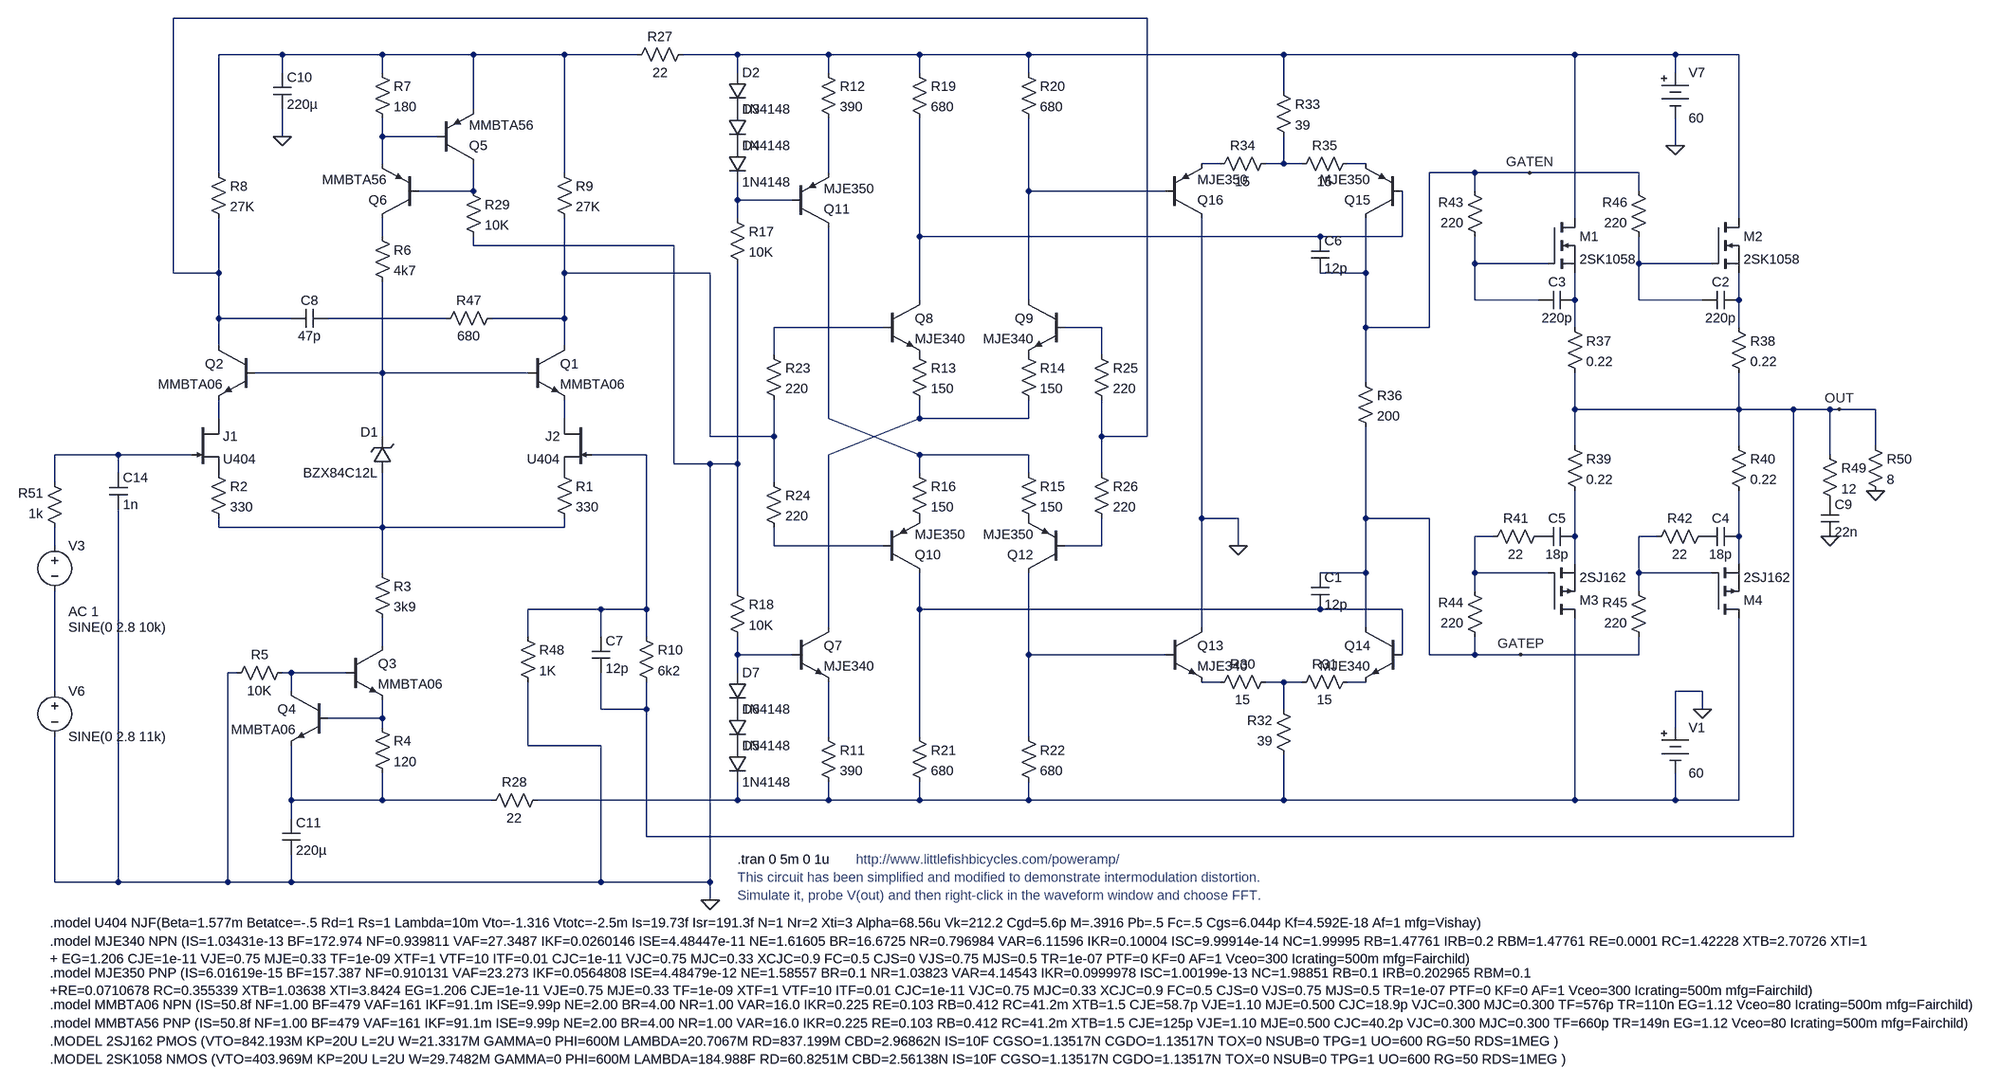
[diagram p0: schematic IMODdistort.asc]
IMODdistort.asc, the LTspice schematic file:
Version 4
SHEET 1 6100 1520
WIRE 3120 -2672 1408 -2672
WIRE 1600 -2608 1488 -2608
WIRE 1776 -2608 1600 -2608
WIRE 1936 -2608 1776 -2608
WIRE 2096 -2608 1936 -2608
WIRE 2224 -2608 2096 -2608
WIRE 2400 -2608 2304 -2608
WIRE 2560 -2608 2400 -2608
WIRE 2720 -2608 2560 -2608
WIRE 2912 -2608 2720 -2608
WIRE 3360 -2608 2912 -2608
WIRE 3872 -2608 3360 -2608
WIRE 4048 -2608 3872 -2608
WIRE 4160 -2608 4048 -2608
WIRE 1600 -2576 1600 -2608
WIRE 1776 -2576 1776 -2608
WIRE 2400 -2576 2400 -2608
WIRE 2560 -2576 2560 -2608
WIRE 2720 -2576 2720 -2608
WIRE 2912 -2576 2912 -2608
WIRE 4048 -2576 4048 -2608
WIRE 3360 -2544 3360 -2608
WIRE 1936 -2512 1936 -2608
WIRE 1600 -2464 1600 -2512
WIRE 1776 -2464 1776 -2496
WIRE 1872 -2464 1776 -2464
WIRE 4048 -2448 4048 -2496
WIRE 1776 -2416 1776 -2464
WIRE 3248 -2416 3216 -2416
WIRE 3360 -2416 3360 -2464
WIRE 3360 -2416 3328 -2416
WIRE 3392 -2416 3360 -2416
WIRE 3504 -2416 3472 -2416
WIRE 1488 -2400 1488 -2608
WIRE 2096 -2400 2096 -2608
WIRE 2560 -2400 2560 -2496
WIRE 3696 -2400 3616 -2400
WIRE 3792 -2400 3696 -2400
WIRE 3984 -2400 3792 -2400
WIRE 1936 -2368 1936 -2416
WIRE 1936 -2368 1840 -2368
WIRE 2912 -2368 2912 -2496
WIRE 3152 -2368 2912 -2368
WIRE 3696 -2368 3696 -2400
WIRE 3984 -2368 3984 -2400
WIRE 2400 -2352 2400 -2384
WIRE 2496 -2352 2400 -2352
WIRE 2400 -2320 2400 -2352
WIRE 3872 -2320 3872 -2608
WIRE 4160 -2320 4160 -2608
WIRE 1776 -2288 1776 -2320
WIRE 2720 -2288 2720 -2496
WIRE 3424 -2288 2720 -2288
WIRE 3568 -2288 3568 -2368
WIRE 3568 -2288 3424 -2288
WIRE 1936 -2272 1936 -2288
WIRE 2288 -2272 1936 -2272
WIRE 3696 -2240 3696 -2288
WIRE 3824 -2240 3696 -2240
WIRE 3984 -2240 3984 -2288
WIRE 4112 -2240 3984 -2240
WIRE 1408 -2224 1408 -2672
WIRE 1488 -2224 1488 -2320
WIRE 1488 -2224 1408 -2224
WIRE 2096 -2224 2096 -2320
WIRE 2352 -2224 2096 -2224
WIRE 3504 -2224 3504 -2320
WIRE 3504 -2224 3424 -2224
WIRE 2720 -2176 2720 -2288
WIRE 2912 -2176 2912 -2368
WIRE 3696 -2176 3696 -2240
WIRE 3808 -2176 3696 -2176
WIRE 3872 -2176 3872 -2224
WIRE 3984 -2176 3984 -2240
WIRE 4096 -2176 3984 -2176
WIRE 4160 -2176 4160 -2224
WIRE 1488 -2144 1488 -2224
WIRE 1616 -2144 1488 -2144
WIRE 1888 -2144 1680 -2144
WIRE 2096 -2144 2096 -2224
WIRE 2096 -2144 1968 -2144
WIRE 2656 -2128 2464 -2128
WIRE 3040 -2128 2976 -2128
WIRE 3504 -2128 3504 -2224
WIRE 3616 -2128 3616 -2400
WIRE 3616 -2128 3504 -2128
WIRE 3872 -2128 3872 -2176
WIRE 4160 -2128 4160 -2176
WIRE 1488 -2096 1488 -2144
WIRE 2096 -2096 2096 -2144
WIRE 2464 -2080 2464 -2128
WIRE 3040 -2080 3040 -2128
WIRE 1776 -2048 1776 -2208
WIRE 1776 -2048 1552 -2048
WIRE 2032 -2048 1776 -2048
WIRE 3504 -2032 3504 -2128
WIRE 3872 -1984 3872 -2048
WIRE 4160 -1984 4160 -2048
WIRE 4160 -1984 3872 -1984
WIRE 4256 -1984 4160 -1984
WIRE 4320 -1984 4256 -1984
WIRE 4336 -1984 4320 -1984
WIRE 4400 -1984 4336 -1984
WIRE 1488 -1968 1488 -2000
WIRE 2096 -1968 2096 -2000
WIRE 2560 -1968 2560 -2304
WIRE 2720 -1968 2720 -2000
WIRE 2912 -1968 2912 -2000
WIRE 2912 -1968 2720 -1968
WIRE 1776 -1936 1776 -2048
WIRE 2352 -1936 2352 -2224
WIRE 2464 -1936 2464 -2000
WIRE 2464 -1936 2352 -1936
WIRE 3040 -1936 3040 -2000
WIRE 3120 -1936 3120 -2672
WIRE 3120 -1936 3040 -1936
WIRE 3872 -1920 3872 -1984
WIRE 4160 -1920 4160 -1984
WIRE 4400 -1920 4400 -1984
WIRE 1312 -1904 1200 -1904
WIRE 1440 -1904 1312 -1904
WIRE 2240 -1904 2144 -1904
WIRE 2560 -1904 2720 -1968
WIRE 2720 -1904 2560 -1968
WIRE 2912 -1904 2720 -1904
WIRE 4320 -1904 4320 -1984
WIRE 2288 -1888 2288 -2272
WIRE 2352 -1888 2288 -1888
WIRE 2400 -1888 2400 -2240
WIRE 2400 -1888 2352 -1888
WIRE 1312 -1872 1312 -1904
WIRE 2720 -1872 2720 -1904
WIRE 2912 -1872 2912 -1904
WIRE 3040 -1872 3040 -1936
WIRE 1200 -1856 1200 -1904
WIRE 2464 -1856 2464 -1936
WIRE 3216 -1792 3216 -2320
WIRE 3280 -1792 3216 -1792
WIRE 3504 -1792 3504 -1952
WIRE 3616 -1792 3504 -1792
WIRE 1488 -1776 1488 -1792
WIRE 1776 -1776 1776 -1872
WIRE 1776 -1776 1488 -1776
WIRE 2096 -1776 2096 -1792
WIRE 2096 -1776 1776 -1776
WIRE 3728 -1760 3696 -1760
WIRE 3872 -1760 3872 -1840
WIRE 4016 -1760 3984 -1760
WIRE 4160 -1760 4160 -1840
WIRE 1200 -1744 1200 -1776
WIRE 2464 -1744 2464 -1776
WIRE 2656 -1744 2464 -1744
WIRE 3040 -1744 3040 -1792
WIRE 3040 -1744 2976 -1744
WIRE 3280 -1744 3280 -1792
WIRE 3872 -1712 3872 -1760
WIRE 4160 -1712 4160 -1760
WIRE 1776 -1696 1776 -1776
WIRE 3504 -1696 3504 -1792
WIRE 3504 -1696 3424 -1696
WIRE 3696 -1696 3696 -1760
WIRE 3824 -1696 3696 -1696
WIRE 3984 -1696 3984 -1760
WIRE 4112 -1696 3984 -1696
WIRE 2400 -1664 2400 -1888
WIRE 3696 -1664 3696 -1696
WIRE 3984 -1664 3984 -1696
WIRE 2160 -1632 2032 -1632
WIRE 2240 -1632 2240 -1904
WIRE 2240 -1632 2160 -1632
WIRE 2720 -1632 2720 -1696
WIRE 3424 -1632 2720 -1632
WIRE 3568 -1632 3424 -1632
WIRE 2560 -1600 2560 -1904
WIRE 3216 -1600 3216 -1792
WIRE 3504 -1600 3504 -1696
WIRE 2032 -1584 2032 -1632
WIRE 2160 -1584 2160 -1632
WIRE 2240 -1584 2240 -1632
WIRE 1776 -1568 1776 -1616
WIRE 2400 -1552 2400 -1584
WIRE 2496 -1552 2400 -1552
WIRE 2912 -1552 2912 -1696
WIRE 3152 -1552 2912 -1552
WIRE 3568 -1552 3568 -1632
WIRE 3616 -1552 3616 -1792
WIRE 3696 -1552 3696 -1584
WIRE 3696 -1552 3616 -1552
WIRE 3776 -1552 3696 -1552
WIRE 3984 -1552 3984 -1584
WIRE 3984 -1552 3776 -1552
WIRE 1520 -1520 1504 -1520
WIRE 1616 -1520 1600 -1520
WIRE 1712 -1520 1616 -1520
WIRE 2400 -1520 2400 -1552
WIRE 3248 -1504 3216 -1504
WIRE 3360 -1504 3328 -1504
WIRE 3392 -1504 3360 -1504
WIRE 3504 -1504 3472 -1504
WIRE 1200 -1488 1200 -1664
WIRE 1616 -1488 1616 -1520
WIRE 4096 -1488 4048 -1488
WIRE 2160 -1456 2160 -1520
WIRE 2240 -1456 2240 -1504
WIRE 2240 -1456 2160 -1456
WIRE 3360 -1456 3360 -1504
WIRE 4096 -1456 4096 -1488
WIRE 1776 -1440 1776 -1472
WIRE 1776 -1440 1680 -1440
WIRE 1776 -1424 1776 -1440
WIRE 4048 -1424 4048 -1488
WIRE 2560 -1408 2560 -1504
WIRE 2720 -1408 2720 -1632
WIRE 2912 -1408 2912 -1552
WIRE 2032 -1392 2032 -1504
WIRE 2160 -1392 2032 -1392
WIRE 1616 -1296 1616 -1392
WIRE 1776 -1296 1776 -1344
WIRE 1776 -1296 1616 -1296
WIRE 1968 -1296 1776 -1296
WIRE 2400 -1296 2400 -1328
WIRE 2400 -1296 2048 -1296
WIRE 2560 -1296 2560 -1328
WIRE 2560 -1296 2400 -1296
WIRE 2720 -1296 2720 -1328
WIRE 2720 -1296 2560 -1296
WIRE 2912 -1296 2912 -1328
WIRE 2912 -1296 2720 -1296
WIRE 3360 -1296 3360 -1376
WIRE 3360 -1296 2912 -1296
WIRE 3872 -1296 3872 -1616
WIRE 3872 -1296 3360 -1296
WIRE 4048 -1296 4048 -1344
WIRE 4048 -1296 3872 -1296
WIRE 4160 -1296 4160 -1616
WIRE 4160 -1296 4048 -1296
WIRE 1616 -1264 1616 -1296
WIRE 2240 -1232 2240 -1456
WIRE 4256 -1232 4256 -1984
WIRE 4256 -1232 2240 -1232
WIRE 1200 -1152 1200 -1408
WIRE 1312 -1152 1312 -1808
WIRE 1312 -1152 1200 -1152
WIRE 1504 -1152 1504 -1520
WIRE 1504 -1152 1312 -1152
WIRE 1616 -1152 1616 -1200
WIRE 1616 -1152 1504 -1152
WIRE 2160 -1152 2160 -1392
WIRE 2160 -1152 1616 -1152
WIRE 2352 -1152 2352 -1888
WIRE 2352 -1152 2160 -1152
WIRE 2352 -1120 2352 -1152
FLAG 4320 -1760 0
FLAG 4400 -1840 0
FLAG 4336 -1984 OUT
FLAG 3776 -1552 GATEP
FLAG 3792 -2400 GATEN
FLAG 2352 -1120 0
FLAG 3280 -1744 0
FLAG 4048 -2448 0
FLAG 4096 -1456 0
FLAG 1600 -2464 0
SYMBOL njf 1440 -1968 R0
SYMATTR InstName J1
SYMATTR Value U404
SYMBOL njf 2144 -1968 M0
SYMATTR InstName J2
SYMATTR Value U404
SYMBOL npn 2032 -2096 R0
SYMATTR InstName Q1
SYMATTR Value MMBTA06
SYMBOL npn 1552 -2096 M0
SYMATTR InstName Q2
SYMATTR Value MMBTA06
SYMBOL res 2080 -1888 R0
SYMATTR InstName R1
SYMATTR Value 330
SYMBOL res 1472 -1888 R0
SYMATTR InstName R2
SYMATTR Value 330
SYMBOL zener 1792 -1872 R180
WINDOW 0 24 72 Left 0
WINDOW 3 24 0 Left 0
SYMATTR InstName D1
SYMATTR Value BZX84C12L
SYMBOL res 1760 -1712 R0
SYMATTR InstName R3
SYMATTR Value 3k9
SYMBOL npn 1712 -1568 R0
SYMATTR InstName Q3
SYMATTR Value MMBTA06
SYMBOL npn 1680 -1488 M0
SYMATTR InstName Q4
SYMATTR Value MMBTA06
SYMBOL res 1760 -1440 R0
SYMATTR InstName R4
SYMATTR Value 120
SYMBOL res 1616 -1536 R90
WINDOW 0 0 56 VBottom 0
WINDOW 3 32 56 VTop 0
SYMATTR InstName R5
SYMATTR Value 10K
SYMBOL pnp 1872 -2416 M180
SYMATTR InstName Q5
SYMATTR Value MMBTA56
SYMBOL pnp 1840 -2320 R180
SYMATTR InstName Q6
SYMATTR Value MMBTA56
SYMBOL res 1760 -2304 R0
SYMATTR InstName R6
SYMATTR Value 4k7
SYMBOL res 1760 -2592 R0
SYMATTR InstName R7
SYMATTR Value 180
SYMBOL res 1472 -2416 R0
SYMATTR InstName R8
SYMATTR Value 27K
SYMBOL res 2080 -2416 R0
SYMATTR InstName R9
SYMATTR Value 27K
SYMBOL diode 2384 -2576 R0
SYMATTR InstName D2
SYMATTR Value 1N4148
SYMBOL diode 2384 -2512 R0
SYMATTR InstName D3
SYMATTR Value 1N4148
SYMBOL diode 2384 -2448 R0
SYMATTR InstName D4
SYMATTR Value 1N4148
SYMBOL diode 2384 -1392 R0
SYMATTR InstName D5
SYMATTR Value 1N4148
SYMBOL diode 2384 -1456 R0
SYMATTR InstName D6
SYMATTR Value 1N4148
SYMBOL diode 2384 -1520 R0
SYMATTR InstName D7
SYMATTR Value 1N4148
SYMBOL npn 2496 -1600 R0
SYMATTR InstName Q7
SYMATTR Value MJE340
SYMBOL npn 2656 -2176 R0
SYMATTR InstName Q8
SYMATTR Value MJE340
SYMBOL npn 2976 -2176 M0
SYMATTR InstName Q9
SYMATTR Value MJE340
SYMBOL pnp 2656 -1696 M180
SYMATTR InstName Q10
SYMATTR Value MJE350
SYMBOL pnp 2496 -2304 M180
SYMATTR InstName Q11
SYMATTR Value MJE350
SYMBOL pnp 2976 -1696 R180
SYMATTR InstName Q12
SYMATTR Value MJE350
SYMBOL res 2544 -1424 R0
SYMATTR InstName R11
SYMATTR Value 390
SYMBOL res 2544 -2592 R0
SYMATTR InstName R12
SYMATTR Value 390
SYMBOL res 2704 -2096 R0
SYMATTR InstName R13
SYMATTR Value 150
SYMBOL res 2896 -2096 R0
SYMATTR InstName R14
SYMATTR Value 150
SYMBOL res 2896 -1888 R0
SYMATTR InstName R15
SYMATTR Value 150
SYMBOL res 2704 -1888 R0
SYMATTR InstName R16
SYMATTR Value 150
SYMBOL res 2384 -2336 R0
SYMATTR InstName R17
SYMATTR Value 10K
SYMBOL res 2384 -1680 R0
SYMATTR InstName R18
SYMATTR Value 10K
SYMBOL res 2704 -2592 R0
SYMATTR InstName R19
SYMATTR Value 680
SYMBOL res 2896 -2592 R0
SYMATTR InstName R20
SYMATTR Value 680
SYMBOL res 2704 -1424 R0
SYMATTR InstName R21
SYMATTR Value 680
SYMBOL res 2896 -1424 R0
SYMATTR InstName R22
SYMATTR Value 680
SYMBOL res 2448 -2096 R0
SYMATTR InstName R23
SYMATTR Value 220
SYMBOL res 2448 -1872 R0
SYMATTR InstName R24
SYMATTR Value 220
SYMBOL res 3024 -2096 R0
SYMATTR InstName R25
SYMATTR Value 220
SYMBOL res 3024 -1888 R0
SYMATTR InstName R26
SYMATTR Value 220
SYMBOL res 2320 -2624 R90
WINDOW 0 0 56 VBottom 0
WINDOW 3 32 56 VTop 0
SYMATTR InstName R27
SYMATTR Value 22
SYMBOL res 2064 -1312 R90
WINDOW 0 0 56 VBottom 0
WINDOW 3 32 56 VTop 0
SYMATTR InstName R28
SYMATTR Value 22
SYMBOL res 1920 -2384 R0
SYMATTR InstName R29
SYMATTR Value 10K
SYMBOL npn 3152 -1600 R0
SYMATTR InstName Q13
SYMATTR Value MJE340
SYMBOL npn 3568 -1600 M0
SYMATTR InstName Q14
SYMATTR Value MJE340
SYMBOL res 3344 -1520 R90
WINDOW 0 0 56 VBottom 0
WINDOW 3 32 56 VTop 0
SYMATTR InstName R30
SYMATTR Value 15
SYMBOL res 3488 -1520 R90
WINDOW 0 0 56 VBottom 0
WINDOW 3 32 56 VTop 0
SYMATTR InstName R31
SYMATTR Value 15
SYMBOL res 3376 -1360 R180
WINDOW 0 36 76 Left 0
WINDOW 3 36 40 Left 0
SYMATTR InstName R32
SYMATTR Value 39
SYMBOL res 3344 -2560 R0
SYMATTR InstName R33
SYMATTR Value 39
SYMBOL res 3344 -2432 R90
WINDOW 0 0 56 VBottom 0
WINDOW 3 32 56 VTop 0
SYMATTR InstName R34
SYMATTR Value 15
SYMBOL res 3488 -2432 R90
WINDOW 0 0 56 VBottom 0
WINDOW 3 32 56 VTop 0
SYMATTR InstName R35
SYMATTR Value 15
SYMBOL pnp 3568 -2320 R180
SYMATTR InstName Q15
SYMATTR Value MJE350
SYMBOL pnp 3152 -2320 M180
SYMATTR InstName Q16
SYMATTR Value MJE350
SYMBOL res 3488 -2048 R0
SYMATTR InstName R36
SYMATTR Value 200
SYMBOL nmos 3824 -2320 R0
SYMATTR InstName M1
SYMATTR Value 2SK1058
SYMBOL nmos 4112 -2320 R0
SYMATTR InstName M2
SYMATTR Value 2SK1058
SYMBOL pmos 3824 -1616 M180
SYMATTR InstName M3
SYMATTR Value 2SJ162
SYMBOL pmos 4112 -1616 M180
SYMATTR InstName M4
SYMATTR Value 2SJ162
SYMBOL res 3856 -2144 R0
SYMATTR InstName R37
SYMATTR Value 0.22
SYMBOL res 4144 -2144 R0
SYMATTR InstName R38
SYMATTR Value 0.22
SYMBOL res 3856 -1936 R0
SYMATTR InstName R39
SYMATTR Value 0.22
SYMBOL res 4144 -1936 R0
SYMATTR InstName R40
SYMATTR Value 0.22
SYMBOL cap 4160 -2192 R90
WINDOW 0 0 32 VBottom 0
WINDOW 3 32 32 VTop 0
SYMATTR InstName C2
SYMATTR Value 220p
SYMBOL cap 3872 -2192 R90
WINDOW 0 0 32 VBottom 0
WINDOW 3 32 32 VTop 0
SYMATTR InstName C3
SYMATTR Value 220p
SYMBOL cap 4160 -1776 R90
WINDOW 0 0 32 VBottom 0
WINDOW 3 32 32 VTop 0
SYMATTR InstName C4
SYMATTR Value 18p
SYMBOL cap 3872 -1776 R90
WINDOW 0 0 32 VBottom 0
WINDOW 3 32 32 VTop 0
SYMATTR InstName C5
SYMATTR Value 18p
SYMBOL res 3824 -1776 R90
WINDOW 0 0 56 VBottom 0
WINDOW 3 32 56 VTop 0
SYMATTR InstName R41
SYMATTR Value 22
SYMBOL res 4112 -1776 R90
WINDOW 0 0 56 VBottom 0
WINDOW 3 32 56 VTop 0
SYMATTR InstName R42
SYMATTR Value 22
SYMBOL res 3712 -2272 R180
WINDOW 0 36 76 Left 0
WINDOW 3 36 40 Left 0
SYMATTR InstName R43
SYMATTR Value 220
SYMBOL res 3712 -1568 R180
WINDOW 0 36 76 Left 0
WINDOW 3 36 40 Left 0
SYMATTR InstName R44
SYMATTR Value 220
SYMBOL res 4000 -1568 R180
WINDOW 0 36 76 Left 0
WINDOW 3 36 40 Left 0
SYMATTR InstName R45
SYMATTR Value 220
SYMBOL res 4000 -2272 R180
WINDOW 0 36 76 Left 0
WINDOW 3 36 40 Left 0
SYMATTR InstName R46
SYMATTR Value 220
SYMBOL res 2016 -1600 R0
SYMATTR InstName R48
SYMATTR Value 1K
SYMBOL res 4304 -1920 R0
SYMATTR InstName R49
SYMATTR Value 12
SYMBOL cap 4304 -1824 R0
SYMATTR InstName C9
SYMATTR Value 22n
SYMBOL res 4384 -1936 R0
SYMATTR InstName R50
SYMATTR Value 8
SYMBOL voltage 1200 -1760 R0
WINDOW 3 24 160 Left 0
WINDOW 123 24 132 Left 0
WINDOW 39 0 0 Left 0
SYMATTR Value SINE(0 2.8 10k)
SYMATTR Value2 AC 1
SYMATTR InstName V3
SYMBOL cap 1584 -2576 R0
SYMATTR InstName C10
SYMATTR Value 220µ
SYMATTR SpiceLine V=100
SYMBOL cap 1600 -1264 R0
SYMATTR InstName C11
SYMATTR Value 220µ
SYMATTR SpiceLine V=100
SYMBOL res 2224 -1600 R0
SYMATTR InstName R10
SYMATTR Value 6k2
SYMBOL cap 3408 -1696 R0
SYMATTR InstName C1
SYMATTR Value 12p
SYMBOL cap 3408 -2288 R0
SYMATTR InstName C6
SYMATTR Value 12p
SYMBOL cap 2144 -1584 R0
SYMATTR InstName C7
SYMATTR Value 12p
SYMBOL cap 1680 -2160 R90
WINDOW 0 0 32 VBottom 0
WINDOW 3 32 32 VTop 0
SYMATTR InstName C8
SYMATTR Value 47p
SYMBOL res 1984 -2160 R90
WINDOW 0 0 56 VBottom 0
WINDOW 3 32 56 VTop 0
SYMATTR InstName R47
SYMATTR Value 680
SYMBOL res 1216 -1760 R180
WINDOW 0 36 76 Left 0
WINDOW 3 36 40 Left 0
SYMATTR InstName R51
SYMATTR Value 1k
SYMBOL cap 1296 -1872 R0
SYMATTR InstName C14
SYMATTR Value 1n
SYMBOL voltage 1200 -1504 R0
WINDOW 123 0 0 Left 0
WINDOW 39 0 0 Left 0
SYMATTR InstName V6
SYMATTR Value SINE(0 2.8 11k)
SYMBOL Misc\\battery 4048 -2592 R0
WINDOW 123 0 0 Left 0
WINDOW 39 0 0 Left 0
SYMATTR InstName V7
SYMATTR Value 60
SYMBOL Misc\\battery 4048 -1440 R0
WINDOW 123 0 0 Left 0
WINDOW 39 0 0 Left 0
SYMATTR InstName V1
SYMATTR Value 60
TEXT 2400 -1192 Left 0 !.tran 0 5m 0 1u
TEXT 1192 -1080 Left 0 !.model U404 NJF(Beta=1.577m Betatce=-.5 Rd=1 Rs=1 Lambda=10m Vto=-1.316 Vtotc=-2.5m Is=19.73f Isr=191.3f N=1 Nr=2 Xti=3 Alpha=68.56u Vk=212.2 Cgd=5.6p M=.3916 Pb=.5 Fc=.5 Cgs=6.044p Kf=4.592E-18 Af=1 mfg=Vishay)
TEXT 1192 -1048 Left 0 !.model MJE340 NPN (IS=1.03431e-13 BF=172.974 NF=0.939811 VAF=27.3487 IKF=0.0260146 ISE=4.48447e-11 NE=1.61605 BR=16.6725 NR=0.796984 VAR=6.11596 IKR=0.10004 ISC=9.99914e-14 NC=1.99995 RB=1.47761 IRB=0.2 RBM=1.47761 RE=0.0001 RC=1.42228 XTB=2.70726 XTI=1\n+ EG=1.206 CJE=1e-11 VJE=0.75 MJE=0.33 TF=1e-09 XTF=1 VTF=10 ITF=0.01 CJC=1e-11 VJC=0.75 MJC=0.33 XCJC=0.9 FC=0.5 CJS=0 VJS=0.75 MJS=0.5 TR=1e-07 PTF=0 KF=0 AF=1 Vceo=300 Icrating=500m mfg=Fairchild)
TEXT 1192 -992 Left 0 !.model MJE350 PNP (IS=6.01619e-15 BF=157.387 NF=0.910131 VAF=23.273 IKF=0.0564808 ISE=4.48479e-12 NE=1.58557 BR=0.1 NR=1.03823 VAR=4.14543 IKR=0.0999978 ISC=1.00199e-13 NC=1.98851 RB=0.1 IRB=0.202965 RBM=0.1 \n+RE=0.0710678 RC=0.355339 XTB=1.03638 XTI=3.8424 EG=1.206 CJE=1e-11 VJE=0.75 MJE=0.33 TF=1e-09 XTF=1 VTF=10 ITF=0.01 CJC=1e-11 VJC=0.75 MJC=0.33 XCJC=0.9 FC=0.5 CJS=0 VJS=0.75 MJS=0.5 TR=1e-07 PTF=0 KF=0 AF=1 Vceo=300 Icrating=500m mfg=Fairchild)
TEXT 1192 -936 Left 0 !.model MMBTA06 NPN (IS=50.8f NF=1.00 BF=479 VAF=161 IKF=91.1m ISE=9.99p NE=2.00 BR=4.00 NR=1.00 VAR=16.0 IKR=0.225 RE=0.103 RB=0.412 RC=41.2m XTB=1.5 CJE=58.7p VJE=1.10 MJE=0.500 CJC=18.9p VJC=0.300 MJC=0.300 TF=576p TR=110n EG=1.12 Vceo=80 Icrating=500m mfg=Fairchild)
TEXT 1192 -904 Left 0 !.model MMBTA56 PNP (IS=50.8f NF=1.00 BF=479 VAF=161 IKF=91.1m ISE=9.99p NE=2.00 BR=4.00 NR=1.00 VAR=16.0 IKR=0.225 RE=0.103 RB=0.412 RC=41.2m XTB=1.5 CJE=125p VJE=1.10 MJE=0.500 CJC=40.2p VJC=0.300 MJC=0.300 TF=660p TR=149n EG=1.12 Vceo=80 Icrating=500m mfg=Fairchild)
TEXT 1192 -840 Left 0 !.MODEL 2SK1058 NMOS (VTO=403.969M KP=20U L=2U W=29.7482M GAMMA=0 PHI=600M LAMBDA=184.988F RD=60.8251M CBD=2.56138N IS=10F CGSO=1.13517N CGDO=1.13517N TOX=0 NSUB=0 TPG=1 UO=600 RG=50 RDS=1MEG )
TEXT 1192 -872 Left 0 !.MODEL 2SJ162 PMOS (VTO=842.193M KP=20U L=2U W=21.3317M GAMMA=0 PHI=600M LAMBDA=20.7067M RD=837.199M CBD=2.96862N IS=10F CGSO=1.13517N CGDO=1.13517N TOX=0 NSUB=0 TPG=1 UO=600 RG=50 RDS=1MEG )
TEXT 2608 -1192 Left 0 ;http://www.littlefishbicycles.com/poweramp/
TEXT 2400 -1160 Left 0 ;This circuit has been simplified and modified to demonstrate intermodulation distortion.\nSimulate it, probe V(out) and then right-click in the waveform window and choose FFT.

The netlist it stands for:
* IMODdistort.asc
J1 N023 N027 P001 U404
J2 N024 N028 P002 U404
Q1 N016 N022 N024 0 MMBTA06
Q2 N001 N022 N023 0 MMBTA06
R1 P002 N029 330
R2 P001 N029 330
D1 N029 N022 BZX84C12L
R3 N029 N038 3k9
Q3 N038 N041 N046 0 MMBTA06
Q4 N041 N046 N048 0 MMBTA06
R4 N046 N048 120
R5 N041 0 10K
Q5 N009 N004 N002 0 MMBTA56
Q6 N012 N009 N004 0 MMBTA56
R6 N012 N022 4k7
R7 N002 N004 180
R8 N002 N001 27K
R9 N002 N016 27K
D2 N003 P003 1N4148
D3 P003 P004 1N4148
D4 P004 N011 1N4148
D5 P005 N049 1N4148
D6 P006 P005 1N4148
D7 N039 P006 1N4148
Q7 N026 N039 N047 0 MJE340
Q8 N013 N020 P007 0 MJE340
Q9 N010 N021 P008 0 MJE340
Q10 N037 N035 P009 0 MJE350
Q11 N025 N011 N008 0 MJE350
Q12 N040 N036 P010 0 MJE350
R11 N047 N049 390
R12 N003 N008 390
R13 P007 N026 150
R14 P008 N026 150
R15 N025 P010 150
R16 N025 P009 150
R17 N011 0 10K
R18 0 N039 10K
R19 N003 N013 680
R20 N003 N010 680
R21 N037 N049 680
R22 N040 N049 680
R23 N020 N016 220
R24 N016 N035 220
R25 N021 N001 220
R26 N001 N036 220
R27 N003 N002 22
R28 N049 N048 22
R29 N009 0 10K
Q13 0 N040 N042 0 MJE340
Q14 GATEP N037 N044 0 MJE340
R30 N043 N042 15
R31 N044 N043 15
R32 N049 N043 39
R33 N003 N006 39
R34 N006 N005 15
R35 N007 N006 15
Q15 GATEN N013 N007 0 MJE350
Q16 0 N010 N005 0 MJE350
R36 GATEN GATEP 200
M1 N003 N014 N017 N017 2SK1058
M2 N003 N015 N018 N018 2SK1058
M3 N049 N030 N031 N031 2SJ162
M4 N049 N032 N033 N033 2SJ162
R37 N017 OUT 0.22
R38 N018 OUT 0.22
R39 OUT N031 0.22
R40 OUT N033 0.22
C2 N018 N015 220p
C3 N017 N014 220p
C4 N033 P011 18p
C5 N031 P012 18p
R41 P012 N030 22
R42 P011 N032 22
R43 N014 GATEN 220
R44 GATEP N030 220
R45 GATEP N032 220
R46 N015 GATEN 220
R48 N028 0 1K
R49 OUT P013 12
C9 P013 0 22n
R50 OUT 0 8
V3 N034 N045 SINE(0 2.8 10k) AC 1
C10 N002 0 220µ V=100
C11 N048 0 220µ V=100
R10 N028 OUT 6k2
C1 GATEP N037 12p
C6 N013 GATEN 12p
C7 N028 OUT 12p
C8 N019 N001 47p
R47 N016 N019 680
R51 N034 N027 1k
C14 N027 0 1n
V6 N045 0 SINE(0 2.8 11k)
V7 N003 0 60
V1 0 N049 60
.model D D
.lib standard.dio
.model NPN NPN
.model PNP PNP
.lib standard.bjt
.model NJF NJF
.model PJF PJF
.lib standard.jft
.model NMOS NMOS
.model PMOS PMOS
.lib standard.mos
.tran 0 5m 0 1u
.model U404 NJF(Beta=1.577m Betatce=-.5 Rd=1 Rs=1 Lambda=10m Vto=-1.316 Vtotc=-2.5m Is=19.73f Isr=191.3f N=1 Nr=2 Xti=3 Alpha=68.56u Vk=212.2 Cgd=5.6p M=.3916 Pb=.5 Fc=.5 Cgs=6.044p Kf=4.592E-18 Af=1 mfg=Vishay)
.model MJE340 NPN (IS=1.03431e-13 BF=172.974 NF=0.939811 VAF=27.3487 IKF=0.0260146 ISE=4.48447e-11 NE=1.61605 BR=16.6725 NR=0.796984 VAR=6.11596 IKR=0.10004 ISC=9.99914e-14 NC=1.99995 RB=1.47761 IRB=0.2 RBM=1.47761 RE=0.0001 RC=1.42228 XTB=2.70726 XTI=1
+ EG=1.206 CJE=1e-11 VJE=0.75 MJE=0.33 TF=1e-09 XTF=1 VTF=10 ITF=0.01 CJC=1e-11 VJC=0.75 MJC=0.33 XCJC=0.9 FC=0.5 CJS=0 VJS=0.75 MJS=0.5 TR=1e-07 PTF=0 KF=0 AF=1 Vceo=300 Icrating=500m mfg=Fairchild)
.model MJE350 PNP (IS=6.01619e-15 BF=157.387 NF=0.910131 VAF=23.273 IKF=0.0564808 ISE=4.48479e-12 NE=1.58557 BR=0.1 NR=1.03823 VAR=4.14543 IKR=0.0999978 ISC=1.00199e-13 NC=1.98851 RB=0.1 IRB=0.202965 RBM=0.1
+RE=0.0710678 RC=0.355339 XTB=1.03638 XTI=3.8424 EG=1.206 CJE=1e-11 VJE=0.75 MJE=0.33 TF=1e-09 XTF=1 VTF=10 ITF=0.01 CJC=1e-11 VJC=0.75 MJC=0.33 XCJC=0.9 FC=0.5 CJS=0 VJS=0.75 MJS=0.5 TR=1e-07 PTF=0 KF=0 AF=1 Vceo=300 Icrating=500m mfg=Fairchild)
.model MMBTA06 NPN (IS=50.8f NF=1.00 BF=479 VAF=161 IKF=91.1m ISE=9.99p NE=2.00 BR=4.00 NR=1.00 VAR=16.0 IKR=0.225 RE=0.103 RB=0.412 RC=41.2m XTB=1.5 CJE=58.7p VJE=1.10 MJE=0.500 CJC=18.9p VJC=0.300 MJC=0.300 TF=576p TR=110n EG=1.12 Vceo=80 Icrating=500m mfg=Fairchild)
.model MMBTA56 PNP (IS=50.8f NF=1.00 BF=479 VAF=161 IKF=91.1m ISE=9.99p NE=2.00 BR=4.00 NR=1.00 VAR=16.0 IKR=0.225 RE=0.103 RB=0.412 RC=41.2m XTB=1.5 CJE=125p VJE=1.10 MJE=0.500 CJC=40.2p VJC=0.300 MJC=0.300 TF=660p TR=149n EG=1.12 Vceo=80 Icrating=500m mfg=Fairchild)
.MODEL 2SK1058 NMOS (VTO=403.969M KP=20U L=2U W=29.7482M GAMMA=0 PHI=600M LAMBDA=184.988F RD=60.8251M CBD=2.56138N IS=10F CGSO=1.13517N CGDO=1.13517N TOX=0 NSUB=0 TPG=1 UO=600 RG=50 RDS=1MEG )
.MODEL 2SJ162 PMOS (VTO=842.193M KP=20U L=2U W=21.3317M GAMMA=0 PHI=600M LAMBDA=20.7067M RD=837.199M CBD=2.96862N IS=10F CGSO=1.13517N CGDO=1.13517N TOX=0 NSUB=0 TPG=1 UO=600 RG=50 RDS=1MEG )
* http://www.littlefishbicycles.com/poweramp/
* This circuit has been simplified and modified to demonstrate intermodulation distortion.
* Simulate it, probe V(out) and then right-click in the waveform window and choose FFT.
.backanno
.end